# EAGLE design oledboard (EAGLE 6.5.0)
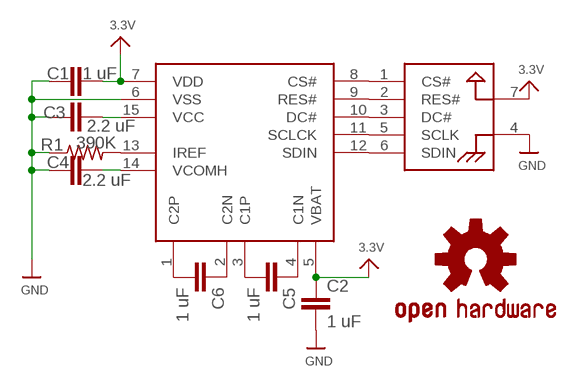
[diagram p0: schematic, sheet 1]

## Parts
C1  1 uF  C-EUC0805  [C0805]
C2  1 uF  C-EUC0805  [C0805]
C3  2.2 uF  C-EUC0805  [C0805]
C4  2.2 uF  C-EUC0805  [C0805]
C5  1 uF  C-EUC0805  [C0805]
C6  1 uF  C-EUC0805  [C0805]
LOGO1  OSHW.SYMS  [OSHW-LOGO-S]
R1  390K  R-US_R0805  [R0805]
U$1  UG-2832HSWEG04  [UG-2832HSWEG04]
U$6  CONNECTOR  [CONNECTOR]

## Nets
3.3V: C1.2 C2.1 U$1.5(VBAT) U$1.7(VDD) U$6.7(GND)
CS: U$1.8(CS#) U$6.1(CS#)
DC: U$1.10(DC#) U$6.3(DC#)
GND: C1.1 C2.2 C3.1 C4.1 R1.1 U$1.6(VSS) U$6.4(3.3V)
N$1: C5.1 U$1.4(C1N)
N$2: C5.2 U$1.3(C1P)
N$3: C6.1 U$1.2(C2N)
N$4: C6.2 U$1.1(C2P)
N$5: R1.2 U$1.13(IREF)
RES: U$1.9(RES#) U$6.2(RES#)
SCLK: U$1.11(SCLCK) U$6.5(SCLK)
SDIN: U$1.12(SDIN) U$6.6(SDIN)
VCC: C3.2 U$1.15(VCC)
VCOMH: C4.2 U$1.14(VCOMH)

## Library data of the parts
C1-C6 = resistor:C-EU: CAPACITOR, European symbol
LOGO1 = OLED:OSHW.SYM: Open Source Hardware Logo This logo indicates the piece of hardware it is found on incorporates a OSHW license and/or adheres to the definition of open source hardware found here: http://freedomdefined.org/OSHW
R1 = rcl:R-US_: RESISTOR, American symbol
U$1 = OLED:UG-2832HSWEG04
U$6 = OLED:CONNECTOR

## Board
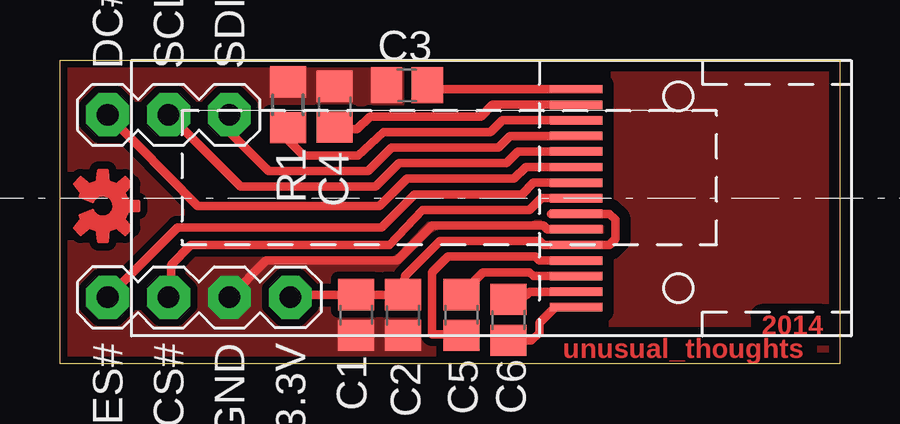
[diagram p1: board, top side]

Size 32.5 x 12.68 mm. Coordinates in mm from the lower left corner, seen from the top.
Outline: 0,12.68 32.5,12.68 32.5,0 0,0 0,12.68
Copper layers (1*16): Top 0.035mm / dielectric 1.5mm / Bottom 0.035mm
Design rules "default *": minimum track width 14mil, minimum drill 24mil, track to track 8mil, track to pad 8mil, pad to pad 8mil, via to via 8mil, smd to smd 8mil, copper to edge 10mil, drill to drill 8mil, minimum pad ring 10mil, minimum via ring 8mil, stop-mask expansion 4mil, vias tented up to drill 0mil, thermal gap 10mil

### Footprints (pad centres in the part's own frame; a part is rotated, then mirrored left to right if it is on the bottom)
C0805 = smd 1.3 x 1.5: 1 -0.85,0; 2 0.85,0
R0805 = smd 1.3 x 1.5: 1 -0.95,0; 2 0.95,0
UG-2832HSWEG04 = smd 2.2 x 0.35: 1 1.535,-4.55; 2 1.535,-3.9; 3 1.535,-3.25; 4 1.535,-2.6; 5 1.535,-1.95; 6 1.535,-1.3; 7 1.535,-0.65; 8 1.535,0; 9 1.535,0.65; 10 1.535,1.3; 11 1.535,1.95; 12 1.535,2.6; 13 1.535,3.25; 14 1.535,3.9; 15 1.535,4.55
CONNECTOR = drill 0.9 pad 1.778 octagon: 1 -2.54,-3.81; 2 -5.08,-3.81; 3 -5.08,3.81; 4 0,-3.81; 5 -2.54,3.81; 6 0,3.81; 7 2.54,-3.81

### Placement (x,y rotation side)
C1  12.35,2.03 90 top
C2  14.3,2.03 270 top
C3  14.46,11.62 0 top
C4  11.46,10.72 270 top
C5  16.74,2.03 90 top
C6  18.7,1.83 270 top
LOGO1  1.79,6.58 270 top
R1  9.51,10.81 270 top
U$1  19.99,6.91 0 top
U$6  7.07,6.58 0 top

### Tracks (layer width: path | path; a pad name or v marks a point on that pad's centre or on a via)
3.3V
  Top 0.356: 20.47,6.26 U$1.7 22.91,6.26 23.16,6.01 23.16,5.2 22.91,4.96 U$1.5 20.15,4.96 19.99,5.12 15.84,5.12 14.38,3.66 C2.1 C1.2 9.72,2.88 U$6.7
CS
  Top 0.356: U$6.1 4.63,2.84 4.63,4.13 5.46,4.96 13.73,4.96 15.11,6.42 19.58,6.42 20.07,6.91 U$1.8
DC
  Top 0.356: U$6.3 5.74,6.58 13.32,6.58 14.46,7.72 18.93,7.72 19.42,8.21 U$1.10
GND
  Top 0.356: U$1.6 20.31,5.61 20.15,5.77 15.52,5.77 14.06,4.31 8.6,4.31 U$6.4
  pour Top (isolate 0.305, no thermals): -0.08,0 20.64,0 28.76,-0.08 32.5,0 32.5,12.84 0,12.68
N$1
  Top 0.356: C5.1 16.74,1.22 15.52,1.22 15.52,3.82 16.17,4.47 19.82,4.47 19.99,4.31 U$1.4
N$2
  Top 0.356: C5.2 16.82,3.01 17.63,3.82 19.58,3.82 19.74,3.66 U$1.3
N$3
  Top 0.356: U$1.2 19.58,3.01 19.42,2.84 C6.1
N$4
  Top 0.356: U$1.1 20.63,2.36 20.63,2.35 19.99,1.71 19.99,1.3 19.66,0.98 C6.2 | 18.44,0.98 C6.2 | C6.2
N$5
  Top 0.356: U$1.13 18.44,10.16 17.96,9.67 13.49,9.67 12.43,8.69 10.16,8.69 9.34,9.51 R1.2
N$13
  pour Top (isolate 0.457, no thermals): 32.5,12.68 15.52,12.68 15.52,11.78 18.93,11.78 18.93,11.62 22.51,11.62 22.51,2.28 20.47,2.36 19.99,1.79 19.66,1.14 19.66,0 32.42,0
RES
  Top 0.356: U$6.2 4.9,5.69 13.41,5.69 14.79,7.07 19.26,7.07 19.74,7.56 U$1.9
SCLK
  Top 0.356: U$6.5 7.53,7.39 13.16,7.39 14.14,8.37 18.61,8.37 19.09,8.86 U$1.11
SDIN
  Top 0.356: U$1.12 18.77,9.51 18.28,9.02 13.81,9.02 12.84,8.04 8.69,8.04 7.09,9.65 U$6.6
VCC
  Top 0.356: C3.2 15.47,11.46 U$1.15
VCOMH
  Top 0.356: C4.2 11.46,9.83 11.49,9.79 12.39,9.79 12.92,10.32 17.55,10.32 18.04,10.81 U$1.14

### Text on the board
Top: 2014 | unusual_thoughts